# Altium schematic sheet 09 - USB.SchDoc
size B; CompanyName: Microchip Technology Inc.; Organization: Microchip Technology; Address1: 2355 West Chandler Blvd.; Address2: Chandler, AZ  85224; Address4: USA; SheetNumber: 10; SheetTotal: 15; SheetTitle: USB; Time: Time
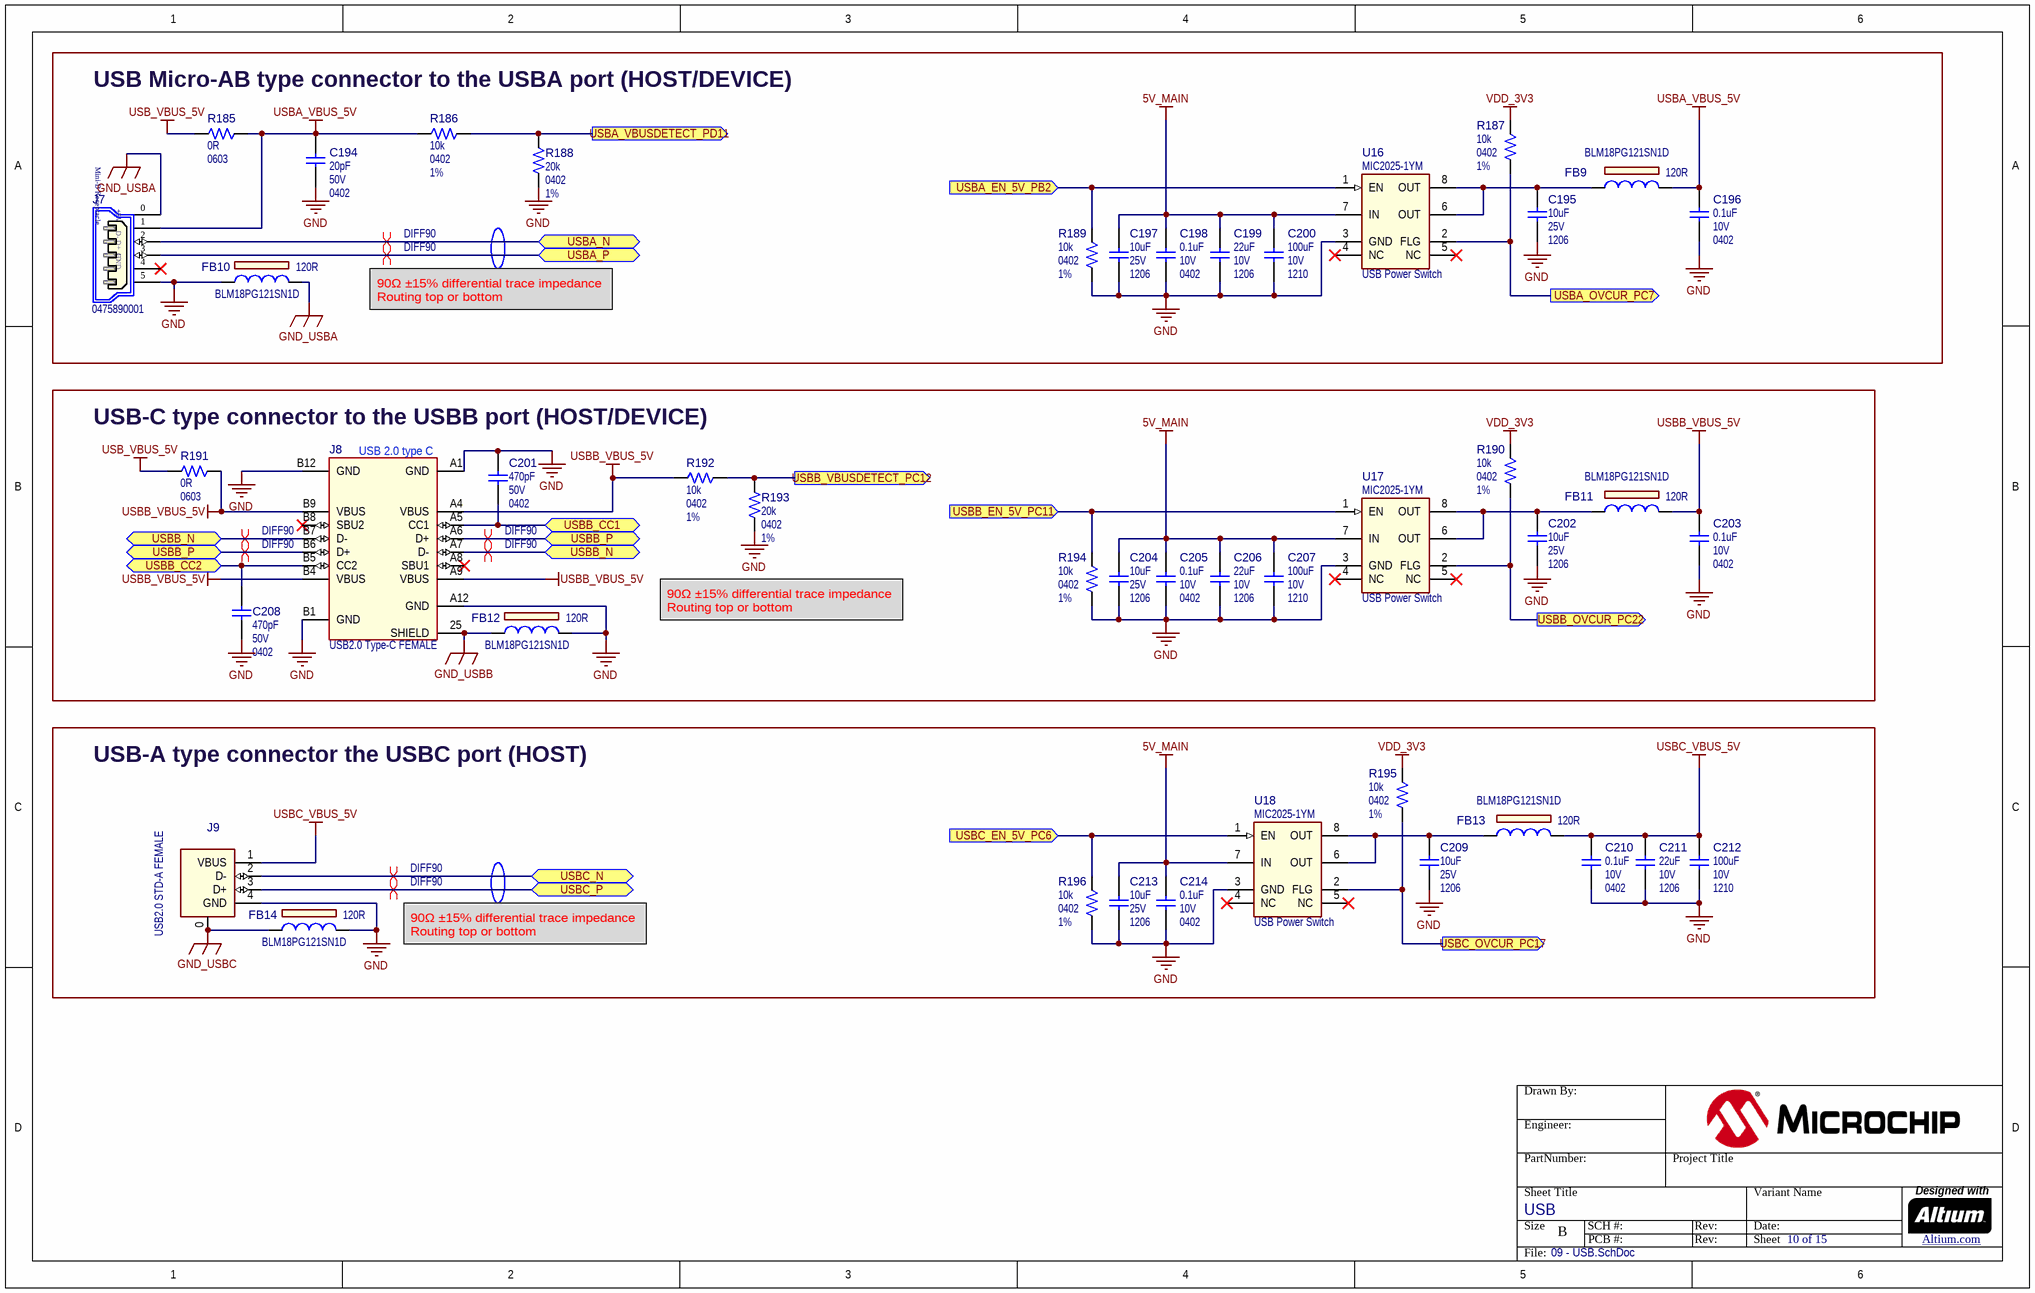
[diagram p0: 09 - USB.SchDoc]

## Parts
?  (no value)  (graphical)
C194  value 20pF  Voltage: 50V  Package: 0402  [CAP_C_0402]  (hidden comment: Capacitor NP)
C195  value 10uF  Voltage: 25V  Package: 1206  [CAP_C_1206]  (hidden comment: Capacitor NP)
C196  value 0.1uF  Voltage: 10V  Package: 0402  [CAP_C_0402]  (hidden comment: Capacitor NP)
C197  value 10uF  Voltage: 25V  Package: 1206  [CAP_C_1206]  (hidden comment: Capacitor NP)
C198  value 0.1uF  Voltage: 10V  Package: 0402  [CAP_C_0402]  (hidden comment: Capacitor NP)
C199  value 22uF  Voltage: 10V  Package: 1206  [CAP_C_1206]  (hidden comment: Capacitor NP)
C200  value 100uF  Voltage: 10V  Package: 1210  [CAP_C_1210]  (hidden comment: Capacitor NP)
C201  value 470pF  Voltage: 50V  Package: 0402  [CAP_C_0402]  (hidden comment: Capacitor NP)
C202  value 10uF  Voltage: 25V  Package: 1206  [CAP_C_1206]  (hidden comment: Capacitor NP)
C203  value 0.1uF  Voltage: 10V  Package: 0402  [CAP_C_0402]  (hidden comment: Capacitor NP)
C204  value 10uF  Voltage: 25V  Package: 1206  [CAP_C_1206]  (hidden comment: Capacitor NP)
C205  value 0.1uF  Voltage: 10V  Package: 0402  [CAP_C_0402]  (hidden comment: Capacitor NP)
C206  value 22uF  Voltage: 10V  Package: 1206  [CAP_C_1206]  (hidden comment: Capacitor NP)
C207  value 100uF  Voltage: 10V  Package: 1210  [CAP_C_1210]  (hidden comment: Capacitor NP)
C208  value 470pF  Voltage: 50V  Package: 0402  [CAP_C_0402]  (hidden comment: Capacitor NP)
C209  value 10uF  Voltage: 25V  Package: 1206  [CAP_C_1206]  (hidden comment: Capacitor NP)
C210  value 0.1uF  Voltage: 10V  Package: 0402  [CAP_C_0402]  (hidden comment: Capacitor NP)
C211  value 22uF  Voltage: 10V  Package: 1206  [CAP_C_1206]  (hidden comment: Capacitor NP)
C212  value 100uF  Voltage: 10V  Package: 1210  [CAP_C_1210]  (hidden comment: Capacitor NP)
C213  value 10uF  Voltage: 25V  Package: 1206  [CAP_C_1206]  (hidden comment: Capacitor NP)
C214  value 0.1uF  Voltage: 10V  Package: 0402  [CAP_C_0402]  (hidden comment: Capacitor NP)
FB9  value 120R  Manufacturer Part Number 1: BLM18PG121SN1D  [IND_C_0603]  (hidden comment: Ferrite Bead)
FB10  value 120R  Manufacturer Part Number 1: BLM18PG121SN1D  [IND_C_0603]  (hidden comment: Ferrite Bead)
FB11  value 120R  Manufacturer Part Number 1: BLM18PG121SN1D  [IND_C_0603]  (hidden comment: Ferrite Bead)
FB12  value 120R  Manufacturer Part Number 1: BLM18PG121SN1D  [IND_C_0603]  (hidden comment: Ferrite Bead)
FB13  value 120R  Manufacturer Part Number 1: BLM18PG121SN1D  [IND_C_0603]  (hidden comment: Ferrite Bead)
FB14  value 120R  Manufacturer Part Number 1: BLM18PG121SN1D  [IND_C_0603]  (hidden comment: Ferrite Bead)
J7  value 0475890001  [CON_USB_Micro-AB_SMD_RA_MOLEX_0475890001]  (hidden comment: CON USB2.0 Mini_Micro)
J8  value USB2.0 Type-C FEMALE  [CON_USB2.0-C_SMD_RA_HIROSE_CX90M-16P]  (hidden comment: CX90M-16P)
J9  value USB2.0 STD-A FEMALE  [CON_USB2.0-A_TH_RA_FCI_87520-0010BLF]  (hidden comment: CON USB2.0 A-B)
R185  value 0R  Package: 0603  [RES_C_0603]  (hidden comment: Resistor)
R186  value 10k  Package: 0402  Tolerance: 1%  [RES_C_0402]  (hidden comment: Resistor)
R187  value 10k  Package: 0402  Tolerance: 1%  [RES_C_0402]  (hidden comment: Resistor)
R188  value 20k  Package: 0402  Tolerance: 1%  [RES_C_0402]  (hidden comment: Resistor)
R189  value 10k  Package: 0402  Tolerance: 1%  [RES_C_0402]  (hidden comment: Resistor)
R190  value 10k  Package: 0402  Tolerance: 1%  [RES_C_0402]  (hidden comment: Resistor)
R191  value 0R  Package: 0603  [RES_C_0603]  (hidden comment: Resistor)
R192  value 10k  Package: 0402  Tolerance: 1%  [RES_C_0402]  (hidden comment: Resistor)
R193  value 20k  Package: 0402  Tolerance: 1%  [RES_C_0402]  (hidden comment: Resistor)
R194  value 10k  Package: 0402  Tolerance: 1%  [RES_C_0402]  (hidden comment: Resistor)
R195  value 10k  Package: 0402  Tolerance: 1%  [RES_C_0402]  (hidden comment: Resistor)
R196  value 10k  Package: 0402  Tolerance: 1%  [RES_C_0402]  (hidden comment: Resistor)
U16  value USB Power Switch  Manufacturer Part Number 1: MIC2025-1YM  [SOIC-8]  (hidden comment: MCHP ANALOG POWER SWITCH 5.5V 0.7A MIC2025-1YM SOIC8)
U17  value USB Power Switch  Manufacturer Part Number 1: MIC2025-1YM  [SOIC-8]  (hidden comment: MCHP ANALOG POWER SWITCH 5.5V 0.7A MIC2025-1YM SOIC8)
U18  value USB Power Switch  Manufacturer Part Number 1: MIC2025-1YM  [SOIC-8]  (hidden comment: MCHP ANALOG POWER SWITCH 5.5V 0.7A MIC2025-1YM SOIC8)

## Blocks framed on the sheet
USB Micro-AB type connector to the USBA port (HOST/DEVICE): C194-C200 FB9 FB10 J7 R185-R189 U16
USB-C type connector to the USBB port (HOST/DEVICE): C201-C208 FB11 FB12 J8 R190-R194 U17
USB-A type connector the USBC port (HOST): C209-C214 FB13 FB14 J9 R195 R196 U18

## Ports
USBA_EN_5V_PB2 (in), USBA_N (bidir), USBA_OVCUR_PC7 (out), USBA_P (bidir), USBA_VBUSDETECT_PD11 (out), USBB_CC1 (bidir), USBB_CC2 (bidir), USBB_EN_5V_PC11 (in), USBB_N (bidir), USBB_OVCUR_PC22 (out), USBB_P (bidir), USBB_VBUSDETECT_PC12 (out), USBC_EN_5V_PC6 (in), USBC_N (bidir), USBC_OVCUR_PC17 (out), USBC_P (bidir)

## Nets
5V_MAIN: C197.1 C198.2 C199.2 C200.2 C204.1 C205.2 C206.2 C207.2 C213.1 C214.2 U16.7(IN) U17.7(IN) U18.7(IN)
GND: C194.1 C195.2 C196.1 C197.2 C198.1 C199.1 C200.1 C201.2 C202.2 C203.1 C204.2 C205.1 C206.1 C207.1 C208.1 C209.2 C210.1 C211.1 C212.1 C213.2 C214.1 FB10.1 FB12.2 FB14.2 J7.5(GND) J8.A1(GND) J8.A12(GND) J8.B1(GND) J8.B12(GND) J9.4(GND) R188.1 R189.2 R193.1 R194.2 R196.2 U16.3(GND) U17.3(GND) U18.3(GND)
GND_USBA: FB10.2 J7.0(SHLD)
GND_USBB: FB12.1 J8.25(SHIELD)
GND_USBC: FB14.1 J9.0(SHLD)
USB_VBUS_5V: R185.1 R191.1
USBA_VBUS_5V: C194.2 C196.2 FB9.2 J7.1(VBUS) R185.2 R186.2
USBB_VBUS_5V: C203.2 FB11.2 J8.A4(VBUS) J8.A9(VBUS) J8.B4(VBUS) J8.B9(VBUS) R191.2 R192.2
USBC_VBUS_5V: C210.2 C211.2 C212.2 FB13.2 J9.1(VBUS)
VDD_3V3: R187.1 R190.1 R195.1
USBA_EN_5V_PB2: R189.1 U16.1(EN) ; port USBA_EN_5V_PB2
USBA_N: J7.2(D-) ; port USBA_N
USBA_OVCUR_PC7: R187.2 U16.2(FLG) ; port USBA_OVCUR_PC7
USBA_P: J7.3(D+) ; port USBA_P
USBA_VBUSDETECT_PD11: R186.1 R188.2 ; port USBA_VBUSDETECT_PD11
USBB_CC1: C201.1 J8.A5(CC1) ; port USBB_CC1
USBB_CC2: C208.2 J8.B5(CC2) ; port USBB_CC2
USBB_EN_5V_PC11: R194.1 U17.1(EN) ; port USBB_EN_5V_PC11
USBB_N: J8.A7(D-) J8.B7(D-) ; port USBB_N
USBB_OVCUR_PC22: R190.2 U17.2(FLG) ; port USBB_OVCUR_PC22
USBB_P: J8.A6(D+) J8.B6(D+) ; port USBB_P
USBB_VBUSDETECT_PC12: R192.1 R193.2 ; port USBB_VBUSDETECT_PC12
USBC_EN_5V_PC6: R196.1 U18.1(EN) ; port USBC_EN_5V_PC6
USBC_N: J9.2(D-) ; port USBC_N
USBC_OVCUR_PC17: R195.2 U18.2(FLG) ; port USBC_OVCUR_PC17
USBC_P: J9.3(D+) ; port USBC_P
NetC195_1: C195.1 FB9.1 U16.6(OUT) U16.8(OUT)
NetC202_1: C202.1 FB11.1 U17.6(OUT) U17.8(OUT)
NetC209_1: C209.1 FB13.1 U18.6(OUT) U18.8(OUT)

Not connected (* = marked no-connect by the designer): J7 4(ID)*; J8 A8(SBU1)* B8(SBU2)*; U16 4(NC)* 5(NC)*; U17 4(NC)* 5(NC)*; U18 4(NC)* 5(NC)*

## Layout directives
differential pair; differential pair class DIFF90; net class DIFF90; rule Matched Net Lengths [Tolerance = 0.1mm]: USBA_N, USBA_P, USBB_N, USBB_P, USBC_N, USBC_P

## Notes on the sheet
- 90Ω ±15% differential trace impedance
  Routing top or bottom
- Drawn By:
- Engineer:
- PartNumber:
- Project Title
- Sheet Title
- Size
- B
- SCH #:
- PCB #:
- Rev:
- Variant Name
- Date:
- Sheet
- Designed with
- Altium.com <http://go.altium.com/MicrochipLandingPage_Evaluation.html>
- File:
- (in symbol CON1753) +5V; Mini-B Receptacle
- (in symbol CON1944) USB 2.0 type C

## Library data of the parts
? = Title Block B
C194 = CAP2438: Manufacturer 1: Samsung Electro-Mechanics; Manufacturer Part Number 1: CL05C200GB51PNC; Description_: Ceramic capacitor, SMD 0402, 20pF, C0G, 50V, +/-2%; Dev Tools Status: Design; Tolerance: 2%; Temperature Coeffcient: C0G; Type: Ceramic; Populated: YES; Owner: Dragos Danaila; MCHP-ID: CAP2438; Revision: 1; Symbol: Capacitor NP; Status: MCL Design; ComponentLink1Description: SVN Datasheet; ComponentLink2Description: Local Datasheet; ComponentLink3URL: C:\ALTIUM_WORK\00001_MCHP-CDB\Library\LibraryRefs\Capacitor NP.SchLib; ComponentLink3Description: Open Symbol; ComponentLink4URL: C:\ALTIUM_WORK\00001_MCHP-CDB\Library\Footprints\CAP_C_0402.PcbLib; ComponentLink4Description: Open Footprint; ComponentLink5Description: Open Footprint 2; ComponentLink6Description: Open Footprint 3; ComponentLink7Description: Open Footprint 4; Operating Temperature: -55C to +125C; Category: Capacitor; Supplier 1: Digikey; Supplier Part Number 1: 1276-CL05C200GB51PNCTR-ND; Quantity Override: 1
C195 C197 C202 C204 C209 C213 = CAP1418: Capacitor; Manufacturer 1: Samsung Electro-Mechanics America, Inc; Manufacturer Part Number 1: CL31B106KAHNFNE; Description_: CAP CER 10uF 25V 10% X7R SMD 1206; Dev Tools Status: Design; Tolerance: 10%; Temperature Coeffcient: X7R; Type: Ceramic; Populated: YES; Owner: Sorin Stanoaia; MCHP-ID: CAP1418; Revision: A; Symbol: Capacitor NP; Status: MCL Design; ComponentLink1URL: https://chn-vm-apps.microchip.com/mchprepo/parts/Datasheets/C_CL31B106KAHNFNE.pdf; ComponentLink1Description: SVN Datasheet; ComponentLink2URL: C:\ALTIUM_WORK\00001_MCHP-CDB\Datasheets\C_CL31B106KAHNFNE.pdf; ComponentLink2Description: Local Datasheet; ComponentLink3URL: C:\ALTIUM_WORK\00001_MCHP-CDB\Library\LibraryRefs\Capacitor NP.SchLib; ComponentLink3Description: Open Symbol; ComponentLink4URL: C:\ALTIUM_WORK\00001_MCHP-CDB\Library\Footprints\CAP_C_1206.PcbLib; ComponentLink4Description: Open Footprint; ComponentLink5Description: Open Footprint 2; ComponentLink6Description: Open Footprint 3; ComponentLink7Description: Open Footprint 4; Operating Temperature: -55C to +125C; Category: Capacitor; Supplier 1: Digi-Key; Supplier Part Number 1: 1276-3100-1-ND; Quantity Override: 1
C196 C198 C203 C205 C210 C214 = CAP1238: Capacitor; Manufacturer 1: KEMET; Manufacturer Part Number 1: C0402C104K8RACTU; Description_: CAP CER 0.1uF 10V 10% X7R SMD 0402; Dev Tools Status: Production; Tolerance: 10%; Temperature Coeffcient: X7R; Type: Ceramic; Owner: Tad Ahlvers; Populated: YES; MCHP-ID: CAP1238; Revision: 1; Symbol: Capacitor NP; Status: MCL Design; ComponentLink1URL: https://chn-vm-apps.microchip.com/mchprepo/parts/Datasheets/KEM_C1002_X7R_SMD.pdf; ComponentLink1Description: SVN Datasheet; ComponentLink2URL: C:\ALTIUM_WORK\00001_MCHP-CDB\Datasheets\KEM_C1002_X7R_SMD.pdf; ComponentLink2Description: Local Datasheet; ComponentLink3URL: C:\ALTIUM_WORK\00001_MCHP-CDB\Library\LibraryRefs\Capacitor NP.SchLib; ComponentLink3Description: Open Symbol; ComponentLink4URL: C:\ALTIUM_WORK\00001_MCHP-CDB\Library\Footprints\CAP_C_0402.PcbLib; ComponentLink4Description: Open Footprint; ComponentLink5Description: Open Footprint 2; ComponentLink6Description: Open Footprint 3; ComponentLink7Description: Open Footprint 4; Operating Temperature: -55C to +125C; Category: Capacitor; Manufacturer 2: Samsung; Manufacturer Part Number 2: CL05B104KP5NNNC; Manufacturer 3: Murata Electronics; Manufacturer Part Number 3: GRM155R71A104KA01D; Supplier 1: Digi-Key; Supplier Part Number 1: 399-3520-2-ND; Supplier 2: Digi-Key; Supplier Part Number 2: 1276-1002-2-ND; Supplier 3: Mouser; Supplier Part Number 3: 81-GRM155R71A104KA1D; Quantity Override: 1
C199 C206 C211 = CAP1259: Capacitor; Manufacturer 1: Samsung Electro-Mechanics America, Inc; Manufacturer Part Number 1: CL31B226KPHNNNE; Description_: CAP CER 22uF 10V 10% X7R SMD 1206; Dev Tools Status: Production; Tolerance: 10%; Temperature Coeffcient: X7R; Type: Ceramic; Owner: Bogdan Popescu; Populated: YES; MCHP-ID: CAP1259; Revision: 1; Symbol: Capacitor NP; Status: MCL Design; ComponentLink1URL: https://chn-vm-apps.microchip.com/mchprepo/parts/Datasheets/CL31B226KPHNNNE.pdf; ComponentLink1Description: SVN Datasheet; ComponentLink2URL: C:\ALTIUM_WORK\00001_MCHP-CDB\Datasheets\CL31B226KPHNNNE.pdf; ComponentLink2Description: Local Datasheet; ComponentLink3URL: C:\ALTIUM_WORK\00001_MCHP-CDB\Library\LibraryRefs\Capacitor NP.SchLib; ComponentLink3Description: Open Symbol; ComponentLink4URL: C:\ALTIUM_WORK\00001_MCHP-CDB\Library\Footprints\CAP_C_1206.PcbLib; ComponentLink4Description: Open Footprint; ComponentLink5Description: Open Footprint 2; ComponentLink6Description: Open Footprint 3; ComponentLink7Description: Open Footprint 4; Operating Temperature: -55C to +125C; Category: Capacitor; Supplier 1: Digi-Key; Supplier Part Number 1: 1276-2769-1-ND; Quantity Override: 1
C200 C207 C212 = CAP0598: Capacitor; Manufacturer 1: Murata Electronics North America; Manufacturer Part Number 1: GRM32ER61A107ME20L; Description_: CAP CER 100uF 10V 20% X5R SMD 1210; Dev Tools Status: Production; Tolerance: 20%; Temperature Coeffcient: X5R; Type: Ceramic; Populated: Yes; MCHP-ID: CAP0598; Revision: 1; Symbol: Capacitor NP; Status: MCL Design; ComponentLink1URL: https://chn-vm-apps.microchip.com/mchprepo/parts/Datasheets/mlcc01_e.pdf; ComponentLink1Description: SVN Datasheet; ComponentLink2URL: C:\ALTIUM_WORK\00001_MCHP-CDB\Datasheets\mlcc01_e.pdf; ComponentLink2Description: Local Datasheet; ComponentLink3URL: C:\ALTIUM_WORK\00001_MCHP-CDB\Library\LibraryRefs\Capacitor NP.SchLib; ComponentLink3Description: Open Symbol; ComponentLink4URL: C:\ALTIUM_WORK\00001_MCHP-CDB\Library\Footprints\CAP_C_1210.PcbLib; ComponentLink4Description: Open Footprint; ComponentLink5Description: Open Footprint 2; ComponentLink6Description: Open Footprint 3; ComponentLink7Description: Open Footprint 4; Operating Temperature: -55C to +85C; Category: Capacitor; Manufacturer 2: Taiyo Yuden; Manufacturer Part Number 2: LMK325BJ107MM-T; Supplier 1: Digi-Key; Supplier Part Number 1: 490-9969-1-ND; Supplier 2: Digi-Key; Supplier Part Number 2: 587-1965-1-ND; Quantity Override: 1
C201 C208 = CAP1382: Capacitor; Manufacturer 1: Murata; Manufacturer Part Number 1: GRM1555C1H471JA01D; Description_: CAP CER 470pF 50V 5% NP0 SMD 0402; Dev Tools Status: Production; Tolerance: 5%; Temperature Coeffcient: NP0; Type: Ceramic; Owner: Duane Burt; Populated: YES; MCHP-ID: CAP1382; Revision: 1; Symbol: Capacitor NP; Status: MCL Design; ComponentLink1URL: https://chn-vm-apps.microchip.com/mchprepo/parts/Datasheets/c02e.pdf; ComponentLink1Description: SVN Datasheet; ComponentLink2URL: C:\ALTIUM_WORK\00001_MCHP-CDB\Datasheets\c02e.pdf; ComponentLink2Description: Local Datasheet; ComponentLink3URL: C:\ALTIUM_WORK\00001_MCHP-CDB\Library\LibraryRefs\Capacitor NP.SchLib; ComponentLink3Description: Open Symbol; ComponentLink4URL: C:\ALTIUM_WORK\00001_MCHP-CDB\Library\Footprints\CAP_C_0402.PcbLib; ComponentLink4Description: Open Footprint; ComponentLink5Description: Open Footprint 2; ComponentLink6Description: Open Footprint 3; ComponentLink7Description: Open Footprint 4; Operating Temperature: -55C to +125C; Category: Capacitor; Supplier 1: Digikey; Supplier Part Number 1: 490-1297-1-ND; Quantity Override: 1
FB9-FB14 = IND1009: Manufacturer 1: Murata; Description_: FERRITE 120R@100MHz 2A SMD 0603; Dev Tools Status: Production; Owner: Petnarong Chaijaroong; DCR: 0.05R; Saturation Current: 12A; Populated: Yes; MCHP-ID: IND1009; Revision: 0; Symbol: Ferrite Bead; Status: MCL Design; ComponentLink1URL: https://chn-vm-apps.microchip.com/mchprepo/parts/Datasheets/L0110S0100BLM18P.pdf; ComponentLink1Description: SVN Datasheet; ComponentLink2URL: C:\ALTIUM_WORK\00001_MCHP-CDB\Datasheets\L0110S0100BLM18P.pdf; ComponentLink2Description: Local Datasheet; ComponentLink3URL: C:\ALTIUM_WORK\00001_MCHP-CDB\Library\LibraryRefs\Ferrite Bead.SchLib; ComponentLink3Description: Open Symbol; ComponentLink4URL: C:\ALTIUM_WORK\00001_MCHP-CDB\Library\Footprints\IND_C_0603.PcbLib; ComponentLink4Description: Open Footprint; ComponentLink5Description: Open Footprint 2; ComponentLink6Description: Open Footprint 3; ComponentLink7Description: Open Footprint 4; Operating Temperature: -55C to +125C; Package: 0603; Type: Ferrite Bead; Category: Inductor; Supplier 1: Digi-Key; Supplier Part Number 1: 490-1037-1-ND; Quantity Override: 1
J7 = CON1753: Manufacturer 1: Molex, LLC; Description_: CON USB2.0 MICRO-AB FEMALE SMD R/A; Dev Tools Status: Production; Populated: YES; Owner: Dragos Danaila; Voltage: 30VAC; Current: 1A, 1.8A; Custom Parameters: 10000 mating cycles; MCHP-ID: CON1753; Revision: 1; Symbol: CON USB2.0 Mini_Micro; Status: MCL Design; ComponentLink1URL: https://chn-vm-apps.microchip.com/mchprepo/parts/Datasheets/475890001_sd.pdf; ComponentLink1Description: SVN Datasheet; ComponentLink2URL: C:\ALTIUM_WORK\00001_MCHP-CDB\Datasheets\475890001_sd.pdf; ComponentLink2Description: Local Datasheet; ComponentLink3URL: C:\ALTIUM_WORK\00001_MCHP-CDB\Library\LibraryRefs\CON USB2.0 Mini_Micro.SchLib; ComponentLink3Description: Open Symbol; ComponentLink4URL: C:\ALTIUM_WORK\00001_MCHP-CDB\Library\Footprints\CON_USB_Micro-AB_SMD_RA_MOLEX_0475890001.PcbLib; ComponentLink4Description: Open Footprint; ComponentLink5Description: Open Footprint 2; ComponentLink6Description: Open Footprint 3; ComponentLink7Description: Open Footprint 4; Type: USB; Category: Connector; Manufacturer Part Number 1: 0475890001; Supplier 1: Digi-Key; Supplier Part Number 1: WM17143CT-ND; Quantity Override: 1
J8 = CON1944: USB 2.0 type C connector; Manufacturer 1: Hirose Electric Co Ltd; Description_: CONN USB2.0 TYPE-C Female TH R/A; Dev Tools Status: Design; Owner: Ilie Galan; Populated: YES; MCHP-ID: CON1944; Revision: 1; Symbol: CON USB2.0 C; Status: MCL Design; ComponentLink1URL: https://chn-vm-apps.microchip.com/mchprepo/parts/Datasheets/CX90M-16P_DWG.pdf; ComponentLink1Description: SVN Datasheet; ComponentLink2URL: C:\ALTIUM_WORK\00001_MCHP-CDB\Datasheets\CX90M-16P_DWG.pdf; ComponentLink2Description: Local Datasheet; ComponentLink3URL: C:\ALTIUM_WORK\00001_MCHP-CDB\Library\LibraryRefs\CON USB2.0 C.SchLib; ComponentLink3Description: Open Symbol; ComponentLink4URL: C:\ALTIUM_WORK\00001_MCHP-CDB\Library\Footprints\CON_USB2.0-C_SMD_RA_HIROSE_CX90M-16P.PcbLib; ComponentLink4Description: Open Footprint; ComponentLink5Description: Open Footprint 2; ComponentLink6Description: Open Footprint 3; ComponentLink7Description: Open Footprint 4; Type: USB; Category: Connector; Manufacturer Part Number 1: CX90M-16P; Supplier 1: Digi-Key; Supplier Part Number 1: H126318CT-ND; Quantity Override: 1
J9 = CON0280: Connector USB; Manufacturer 1: TE Connectivity AMP Connectors; Manufacturer Part Number 1: 292303-1; Description_: CON USB2.0 STD-A FEMALE TH R/A; Dev Tools Status: Production; Owner: Bogdan Popescu; Populated: YES; MCHP-ID: CON0280; Revision: 2; Symbol: CON USB2.0 A-B; Status: MCL Design; ComponentLink1URL: https://chn-vm-apps.microchip.com/mchprepo/parts/Datasheets/87520.pdf; ComponentLink1Description: SVN Datasheet; ComponentLink2URL: C:\ALTIUM_WORK\00001_MCHP-CDB\Datasheets\87520.pdf; ComponentLink2Description: Local Datasheet; ComponentLink3URL: C:\ALTIUM_WORK\00001_MCHP-CDB\Library\LibraryRefs\CON USB2.0 A-B.SchLib; ComponentLink3Description: Open Symbol; ComponentLink4URL: C:\ALTIUM_WORK\00001_MCHP-CDB\Library\Footprints\CON_USB2.0-A_TH_RA_FCI_87520-0010BLF.PcbLib; ComponentLink4Description: Open Footprint; ComponentLink5Description: Open Footprint 2; ComponentLink6Description: Open Footprint 3; ComponentLink7Description: Open Footprint 4; Type: USB; Category: Connector; Manufacturer 2: Dongguan Yang Ming Precision Plastic Hardware Electronics Co., Ltd. (ShenZhen YangMing); Manufacturer Part Number 2: YM-02-04-B-18; Supplier 1: Digi-Key; Supplier Part Number 1: A31726-ND; Supplier 2: Raynen; Supplier Part Number 2: PLUG00057C01M; Quantity Override: 1
R185 = RSMT0001: Manufacturer 1: Panasonic; Manufacturer Part Number 1: ERJ-3GSY0R00V; Description_: RES TKF 0R 1/10W SMD 0603; Dev Tools Status: Production; Power: 1/10W; Populated: Yes; MCHP-ID: RSMT0001; Revision: 2; Symbol: Resistor; Status: MCL Design; ComponentLink1URL: https://chn-vm-apps.microchip.com/mchprepo/parts/Datasheets/nrc.pdf; ComponentLink1Description: SVN Datasheet; ComponentLink2URL: C:\ALTIUM_WORK\00001_MCHP-CDB\Datasheets\nrc.pdf; ComponentLink2Description: Local Datasheet; ComponentLink3URL: C:\ALTIUM_WORK\00001_MCHP-CDB\Library\LibraryRefs\Resistor.SchLib; ComponentLink3Description: Open Symbol; ComponentLink4URL: C:\ALTIUM_WORK\00001_MCHP-CDB\Library\Footprints\RES_C_0603.PcbLib; ComponentLink4Description: Open Footprint; ComponentLink5Description: Open Footprint 2; ComponentLink6Description: Open Footprint 3; ComponentLink7Description: Open Footprint 4; Operating Temperature: -55C to +155C; Category: Resistor; Type: RES SMD; Composition: TKF; Manufacturer 2: Panasonic; Manufacturer Part Number 2: ERJ-3GEY0R00V; Manufacturer 3: ROHM; Manufacturer Part Number 3: MCR03EZPJ000; Manufacturer 4: Stackpole Electronics Inc; Manufacturer Part Number 4: RMCF0603ZT0R00; Manufacturer 5: Stackpole Electronics Inc; Manufacturer Part Number 5: RMCF 1/16 0 R; Manufacturer 6: Vishay; Manufacturer Part Number 6: CRCW06030000Z0EA; Manufacturer 7: Yageo; Manufacturer Part Number 7: RC0603JR-070RL; Manufacturer 8: KOA Speer; Manufacturer Part Number 8: RK73Z1JTTP; Manufacturer 9: NIC Components; Manufacturer Part Number 9: NRC06Z0TRF; Supplier 1: Digi-Key; Supplier Part Number 1: P0.0GTR-ND; Supplier 2: Digi-Key; Supplier Part Number 2: RHM0.0GCT-ND; Supplier 3: Digi-Key; Supplier Part Number 3: RMCF0603ZT0R00TR-ND; Supplier 4: Digi-Key; Supplier Part Number 4: RMCF0603ZT0R00CT-ND; Supplier 5: Digi-Key; Supplier Part Number 5: RMCF1/160RTR-ND; Supplier 6: Digi-Key; Supplier Part Number 6: 541-0.0GCT-ND; Supplier 7: Digi-Key; Supplier Part Number 7: 311-0.0GRCT-ND; Supplier 8: KOA Speer; Supplier Part Number 8: RK73Z1JTTP; Supplier 9: NIC Components; Supplier Part Number 9: NRC06Z0TRF; Quantity Override: 1
R186 R192 = RSMT1019: Manufacturer 1: Panasonic; Manufacturer Part Number 1: ERJ-2RKF1002X; Description_: RES TKF 10k 1% 1/10W SMD 0402; Dev Tools Status: Production; Temperature Coeffcient: 100ppm/C; Power: 1/10W; Owner: Brent Lanphear; Populated: Yes; Voltage: 50V; MCHP-ID: RSMT1019; Revision: 2; Symbol: Resistor; Status: MCL Design; ComponentLink1URL: https://chn-vm-apps.microchip.com/mchprepo/parts/Datasheets/AOA0000CE2.pdf; ComponentLink1Description: SVN Datasheet; ComponentLink2URL: C:\ALTIUM_WORK\00001_MCHP-CDB\Datasheets\AOA0000CE2.pdf; ComponentLink2Description: Local Datasheet; ComponentLink3URL: C:\ALTIUM_WORK\00001_MCHP-CDB\Library\LibraryRefs\Resistor.SchLib; ComponentLink3Description: Open Symbol; ComponentLink4URL: C:\ALTIUM_WORK\00001_MCHP-CDB\Library\Footprints\RES_C_0402.PcbLib; ComponentLink4Description: Open Footprint; ComponentLink5Description: Open Footprint 2; ComponentLink6Description: Open Footprint 3; ComponentLink7Description: Open Footprint 4; Category: Resistor; Type: RES SMD; Composition: TKF; Supplier 1: Digi-Key; Supplier Part Number 1: P10.0KLCT-ND; Quantity Override: 1; Operating Temperature: -55C to +155C
R187 R189 R190 R194-R196 = RSMT1019: Manufacturer 1: Panasonic; Manufacturer Part Number 1: ERJ-2RKF1002X; Description_: RES TKF 10k 1% 1/10W SMD 0402; Dev Tools Status: Production; Voltage: 50V; Temperature Coeffcient: 100ppm/C; Power: 1/10W; Owner: Brent Lanphear; Populated: Yes; MCHP-ID: RSMT1019; Revision: 2; Symbol: Resistor; Status: MCL Design; ComponentLink1URL: https://chn-vm-apps.microchip.com/mchprepo/parts/Datasheets/AOA0000CE2.pdf; ComponentLink1Description: SVN Datasheet; ComponentLink2URL: C:\ALTIUM_WORK\00001_MCHP-CDB\Datasheets\AOA0000CE2.pdf; ComponentLink2Description: Local Datasheet; ComponentLink3URL: C:\ALTIUM_WORK\00001_MCHP-CDB\Library\LibraryRefs\Resistor.SchLib; ComponentLink3Description: Open Symbol; ComponentLink4URL: C:\ALTIUM_WORK\00001_MCHP-CDB\Library\Footprints\RES_C_0402.PcbLib; ComponentLink4Description: Open Footprint; ComponentLink5Description: Open Footprint 2; ComponentLink6Description: Open Footprint 3; ComponentLink7Description: Open Footprint 4; Operating Temperature: -55C to +155C; Category: Resistor; Type: RES SMD; Composition: TKF; Supplier 1: Digi-Key; Supplier Part Number 1: P10.0KLCT-ND; Quantity Override: 1
R188 R193 = RSMT1298: Manufacturer 1: Stackpole Electronics Inc; Manufacturer Part Number 1: RMCF0402FT20K0; Description_: RES TKF 20k 1% 1/10W SMD 0402; Dev Tools Status: Design; Temperature Coeffcient: 100ppm/C; Power: 1/16W; Owner: Dragos Danaila; Populated: YES; Voltage: 50V; MCHP-ID: RSMT1298; Revision: 1; Symbol: Resistor; Status: MCL Design; ComponentLink1URL: https://chn-vm-apps.microchip.com/mchprepo/parts/Datasheets/sei-rmcf_rmcp.pdf; ComponentLink1Description: SVN Datasheet; ComponentLink2URL: C:\ALTIUM_WORK\00001_MCHP-CDB\Datasheets\sei-rmcf_rmcp.pdf; ComponentLink2Description: Local Datasheet; ComponentLink3URL: C:\ALTIUM_WORK\00001_MCHP-CDB\Library\LibraryRefs\Resistor.SchLib; ComponentLink3Description: Open Symbol; ComponentLink4URL: C:\ALTIUM_WORK\00001_MCHP-CDB\Library\Footprints\RES_C_0402.PcbLib; ComponentLink4Description: Open Footprint; ComponentLink5Description: Open Footprint 2; ComponentLink6Description: Open Footprint 3; ComponentLink7Description: Open Footprint 4; Operating Temperature: -55C to +155C; Category: Resistor; Type: RES SMD; Composition: TKF; Supplier 1: Digikey; Supplier Part Number 1: RMCF0402FT20K0CT-ND; Quantity Override: 1
R191 = RSMT0001: Manufacturer 1: Panasonic; Manufacturer Part Number 1: ERJ-3GSY0R00V; Description_: RES TKF 0R 1/10W SMD 0603; Dev Tools Status: Production; Power: 1/10W; Populated: DNP; MCHP-ID: RSMT0001; Revision: 2; Symbol: Resistor; Status: MCL Design; ComponentLink1URL: https://chn-vm-apps.microchip.com/mchprepo/parts/Datasheets/nrc.pdf; ComponentLink1Description: SVN Datasheet; ComponentLink2URL: C:\ALTIUM_WORK\00001_MCHP-CDB\Datasheets\nrc.pdf; ComponentLink2Description: Local Datasheet; ComponentLink3URL: C:\ALTIUM_WORK\00001_MCHP-CDB\Library\LibraryRefs\Resistor.SchLib; ComponentLink3Description: Open Symbol; ComponentLink4URL: C:\ALTIUM_WORK\00001_MCHP-CDB\Library\Footprints\RES_C_0603.PcbLib; ComponentLink4Description: Open Footprint; ComponentLink5Description: Open Footprint 2; ComponentLink6Description: Open Footprint 3; ComponentLink7Description: Open Footprint 4; Operating Temperature: -55C to +155C; Category: Resistor; Type: RES SMD; Composition: TKF; Manufacturer 2: Panasonic; Manufacturer Part Number 2: ERJ-3GEY0R00V; Manufacturer 3: ROHM; Manufacturer Part Number 3: MCR03EZPJ000; Manufacturer 4: Stackpole Electronics Inc; Manufacturer Part Number 4: RMCF0603ZT0R00; Manufacturer 5: Stackpole Electronics Inc; Manufacturer Part Number 5: RMCF 1/16 0 R; Manufacturer 6: Vishay; Manufacturer Part Number 6: CRCW06030000Z0EA; Manufacturer 7: Yageo; Manufacturer Part Number 7: RC0603JR-070RL; Manufacturer 8: KOA Speer; Manufacturer Part Number 8: RK73Z1JTTP; Manufacturer 9: NIC Components; Manufacturer Part Number 9: NRC06Z0TRF; Supplier 1: Digi-Key; Supplier Part Number 1: P0.0GTR-ND; Supplier 2: Digi-Key; Supplier Part Number 2: RHM0.0GCT-ND; Supplier 3: Digi-Key; Supplier Part Number 3: RMCF0603ZT0R00TR-ND; Supplier 4: Digi-Key; Supplier Part Number 4: RMCF0603ZT0R00CT-ND; Supplier 5: Digi-Key; Supplier Part Number 5: RMCF1/160RTR-ND; Supplier 6: Digi-Key; Supplier Part Number 6: 541-0.0GCT-ND; Supplier 7: Digi-Key; Supplier Part Number 7: 311-0.0GRCT-ND; Supplier 8: KOA Speer; Supplier Part Number 8: RK73Z1JTTP; Supplier 9: NIC Components; Supplier Part Number 9: NRC06Z0TRF; Quantity Override: 1
U16-U18 = MIC7234: Manufacturer 1: Microchip Technology; Dev Tools Status: Production; Owner: Dragos Danaila; Populated: YES; MCHP-ID: MIC7234; Description_: MCHP ANALOG POWER SWITCH 5.5V 0.7A MIC2025-1YM SOIC8; Symbol: MCHP ANALOG POWER SWITCH 5.5V 0.7A MIC2025-1YM SOIC8; Type: Power Switch; Status: MCL Design; Revision: 1; Category: MCHP-Analog; ComponentLink1Description: SVN Datasheet; ComponentLink2URL: C:\ALTIUM_WORK\00001_MCHP-CDB\Datasheets\MIC2025_2075.pdf; ComponentLink2Description: Local Datasheet; ComponentLink3URL: C:\ALTIUM_WORK\00001_MCHP-CDB\Library\LibraryRefs\MCHP ANALOG POWER SWITCH 5.5V 0.7A MIC2025-1YM SOIC8.SchLib; ComponentLink3Description: Open Symbol; ComponentLink4URL: C:\ALTIUM_WORK\00001_MCHP-CDB\Library\Footprints\SOIC-8.PcbLib; ComponentLink4Description: Open Footprint; ComponentLink5Description: Open Footprint 2; ComponentLink6Description: Open Footprint 3; ComponentLink7Description: Open Footprint 4; Supplier 1: Digi-Key; Supplier Part Number 1: 576-1057-ND; Quantity Override: 1